# EAGLE schematic T01_Synth_Glove_Prototype_Board_Amplifier (EAGLE 7.1.0)
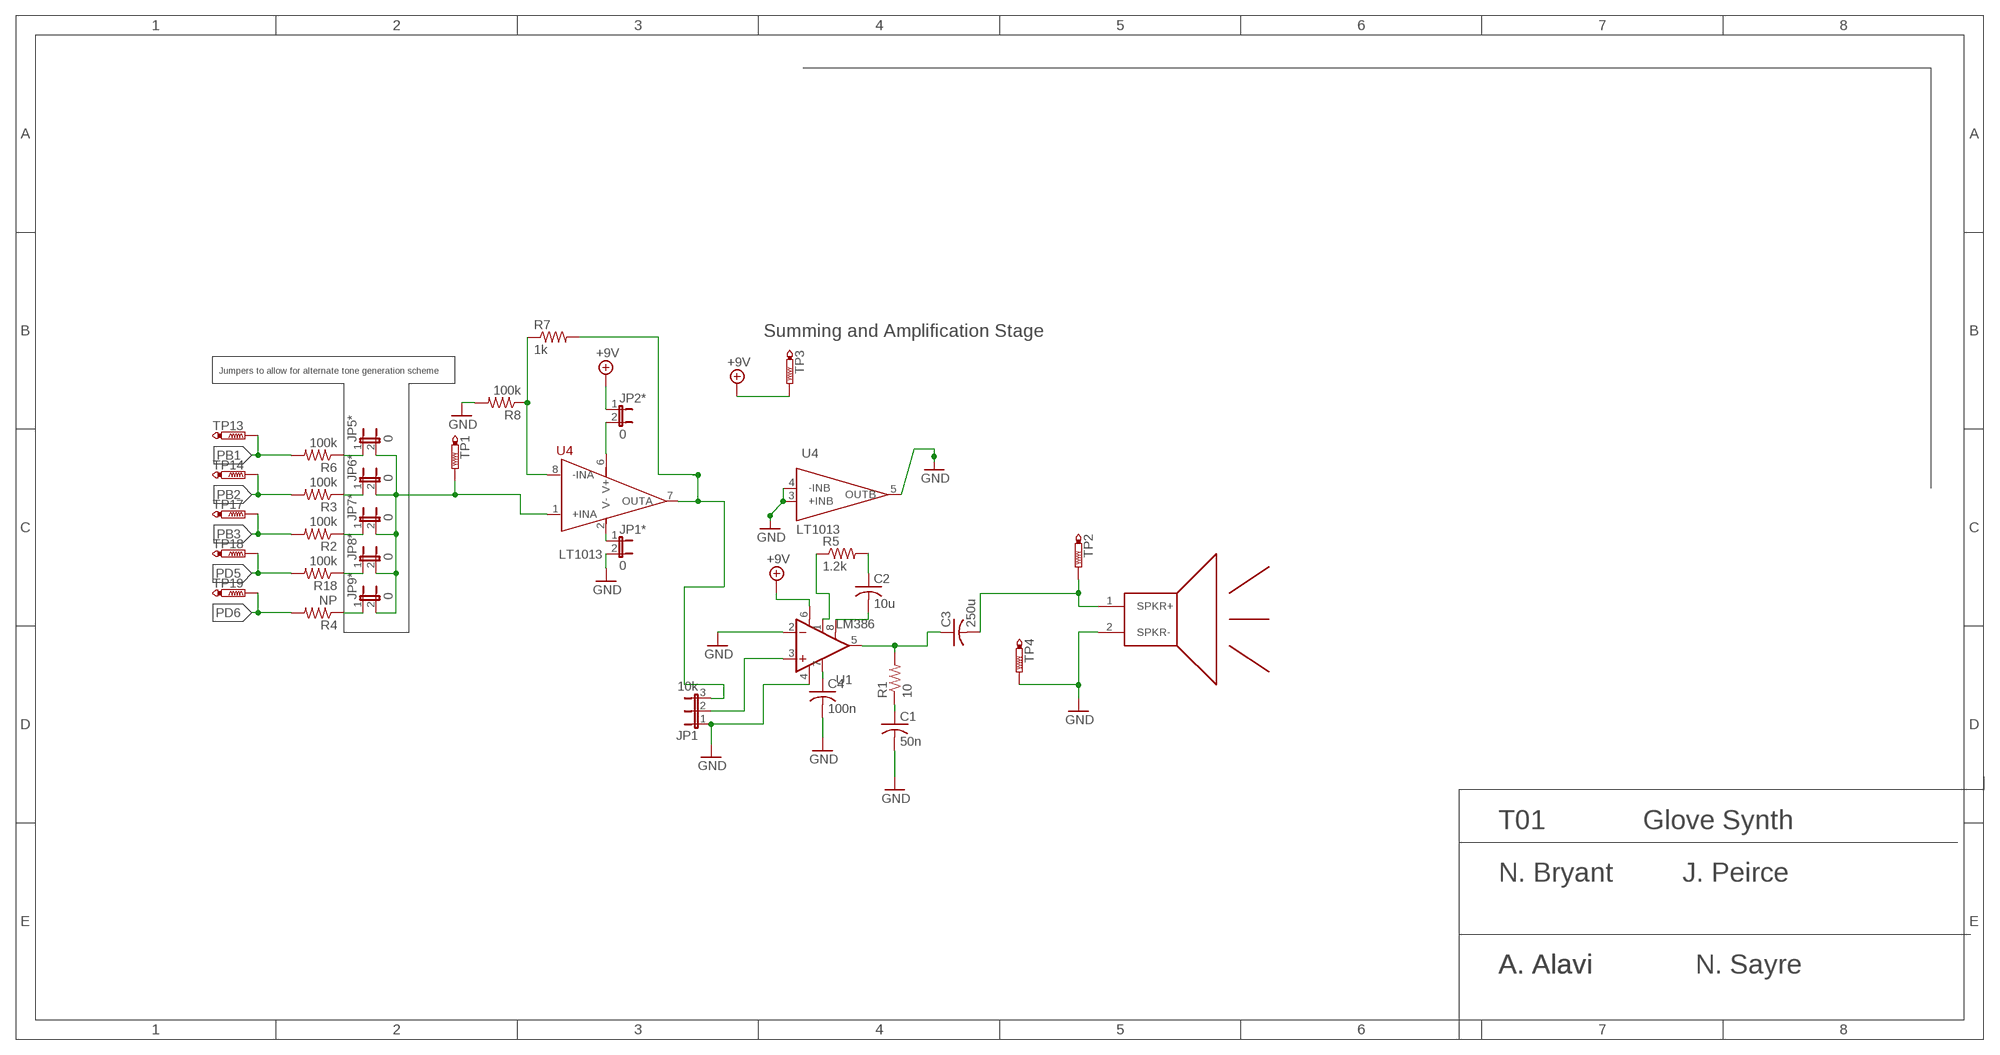
[diagram p0: schematic, sheet 1]

## Parts
C1  50n  C-US025-030X050  [C025-030X050]
C2  10u  C-US025-030X050  [C025-030X050]
C3  250u  C-US025-030X050  [C025-030X050]
C4  100n  C-US025-030X050  [C025-030X050]
JP1  10k  JP2E  [JP2]
JP1*  0  JP1E  [JP1]
JP2*  0  JP1E  [JP1]
JP5*  0  JP1E  [JP1]
JP6*  0  JP1E  [JP1]
JP7*  0  JP1E  [JP1]
JP8*  0  JP1E  [JP1]
JP9*  0  JP1E  [JP1]
R1  10  R-US_0204/2V  [0204V]
R2  100k  RESISTOR0603  [0603-RES]
R3  100k  RESISTOR0603  [0603-RES]
R4  NP  RESISTOR0603  [0603-RES]
R5  1.2k  R-US_0204/2V  [0204V]
R6  100k  RESISTOR0603  [0603-RES]
R7  1k  RESISTOR0603  [0603-RES]
R8  100k  RESISTOR0603  [0603-RES]
R18  100k  RESISTOR0603  [0603-RES]
TP1  PTR1B2,54  [B2,54]
TP2  PTR1B2,54  [B2,54]
TP3  PTR1B2,54  [B2,54]
TP4  PTR1B2,54  [B2,54]
TP13  PTR1B2,54  [B2,54]
TP14  PTR1B2,54  [B2,54]
TP17  PTR1B2,54  [B2,54]
TP18  PTR1B2,54  [B2,54]
TP19  PTR1B2,54  [B2,54]
U1  LM386  [DIP08]
U4  LT1013  [SO08]
U$1  SPEAKER  [JP1]

## Nets
+9V: JP2*.1 TP3.TP U1.6(V+)
GND: C1.2 C4.2 JP1*.2 JP1.1 R8.2 TP4.TP U1.2(-IN) U1.4(V-) U4.3(+INB) U4.4(-INB) U4.5(OUTB) U$1.2(SPKR-)
N$1: C3.1 R1.2 U1.5(OUT)
N$2: JP5*.2 JP6*.2 JP7*.2 JP8*.2 JP9*.2 TP1.TP U4.1(+INA)
N$3: JP1.3 R7.2 U4.7(OUTA)
N$4: C1.1 R1.1
N$5: C3.2 TP2.TP U$1.1(SPKR+)
N$6: C2.2 U1.8(GAIN)
N$7: C2.1 R5.2
N$8: R5.1 U1.1(GAIN)
N$9: C4.1 U1.7(BP)
N$10: JP1.2 U1.3(+IN)
N$16: R7.1 R8.1 U4.8(-INA)
N$18: JP5*.1 R6.1
N$21: JP6*.1 R3.1
N$25: JP7*.1 R2.1
N$26: JP2*.2 U4.6(V+)
N$27: JP8*.1 R18.1
N$32: JP9*.1 R4.1
PB1: R6.2 TP13.TP
PB2: R3.2 TP14.TP
PB3: R2.2 TP17.TP
PD5: R18.2 TP18.TP
PD6: R4.2 TP19.TP
V-: JP1*.1 U4.2(V-)

## Notes on the sheet
- Summing and Amplification Stage
- Jumpers to allow for alternate tone generation scheme
- T01 | Glove Synth
- N. Bryant | J. Peirce
- A. Alavi | A. Alavi | N. Sayre

## Library data of the parts
C1-C4 = adafruit:C-US: CAPACITOR, American symbol
JP1 = jumper:JP2E: JUMPER
JP1* JP2* JP5* JP6* JP7* JP8* JP9* = jumper:JP1E: JUMPER
R1 R5 = adafruit:R-US_: RESISTOR, American symbol
R2-R4 R6-R8 R18 = SparkFun-Resistors:RESISTOR: Resistor Basic schematic elements and footprints for 0603, 1206, and PTH resistors.
TP1-TP4 TP13 TP14 TP17-TP19 = testpad:PTR1: TEST PIN
U1 = SparkFun-AnalogIC:LM386: low voltage audio power amplifier
U4 = Synth_Glove:LT1013: Linear Technology dual input precision op amps
U$1 = Synth_Glove:SPEAKER